# EAGLE design h-bridge-breakout (EAGLE 6.1)
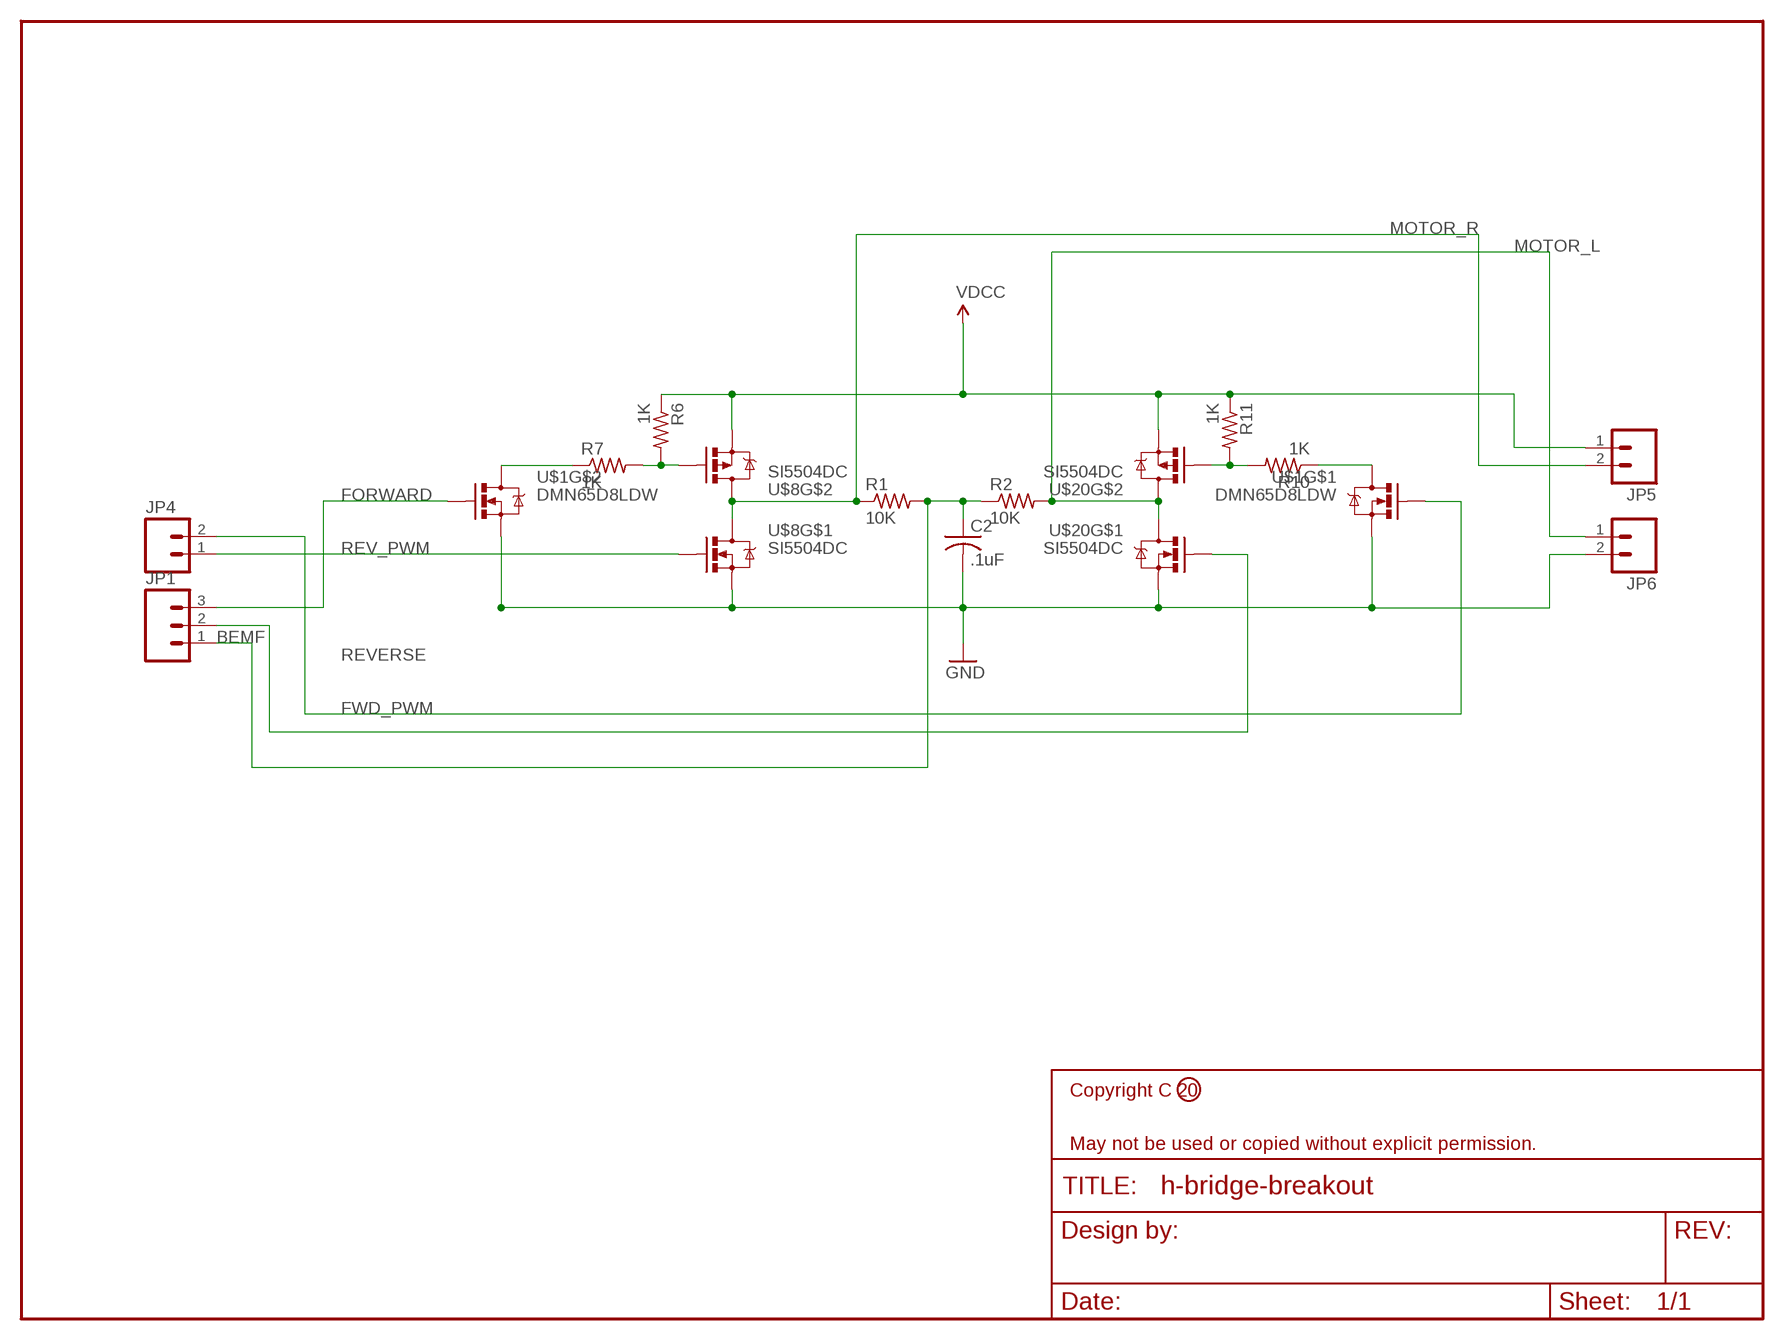
[diagram p0: schematic, sheet 1]

## Parts
C2  .1uF  C-USC0402  [C0402]
JP1  M03SCREW  [SCREWTERMINAL-3.5MM-3]
JP4  M023.5MM  [SCREWTERMINAL-3.5MM-2]
JP5  M023.5MM  [SCREWTERMINAL-3.5MM-2]
JP6  M023.5MM  [SCREWTERMINAL-3.5MM-2]
R1  10K  R-US_R0603  [R0603]
R2  10K  R-US_R0603  [R0603]
R6  1K  R-US_R0603  [R0603]
R7  1K  R-US_R0603  [R0603]
R10  1K  R-US_R0603  [R0603]
R11  1K  R-US_R0603  [R0603]
U$1  DMN65D8LDW  [SOT363]
U$8  SI5504DC  [1206-8]
U$20  SI5504DC  [1206-8]

## Nets
BEMF: C2.1 JP1.1 R1.2 R2.1
FORWARD: JP1.3 U$1.P$5(G)
FWD_PWM: JP1.2 U$20.P$2(G)
GND: C2.2 JP6.2 U$1.P$3(S) U$1.P$6(S) U$8.P$1(S) U$20.P$1(S)
MOTOR_L: JP6.1 R2.2 U$20.P$5(D) U$20.P$6(D) U$20.P$7(D) U$20.P$8(D)
MOTOR_R: JP5.2 R1.1 U$8.P$5(D) U$8.P$6(D) U$8.P$7(D) U$8.P$8(D)
N$1: R6.2 R7.2 U$8.P$4(G)
N$4: R10.2 R11.2 U$20.P$4(G)
N$10: R10.1 U$1.P$4(D)
N$11: R7.1 U$1.P$1(D)
REV_PWM: JP4.1 U$8.P$2(G)
REVERSE: JP4.2 U$1.P$2(G)
VDCC: JP5.1 R6.1 R11.1 U$8.P$3(S) U$20.P$3(S)

## Library data of the parts
C2 = rcl:C-US: CAPACITOR, American symbol
JP1 = SparkFun-Connectors:M03: Header 3 Standard 3-pin 0.1" header. Use with straight break away headers (SKU : PRT-00116), right angle break away headers (PRT-00553), swiss pins (PRT-00743), machine pins (PRT-00117), and female headers (PRT-00115). Molex polarized connector foot print use with SKU : PRT-08232 with associated crimp pins and housings.
JP4-JP6 = SparkFun-Connectors:M02: Header 2 Standard 2-pin 0.1" header. Use with straight break away headers (SKU : PRT-00116), right angle break away headers (PRT-00553), swiss pins (PRT-00743), machine pins (PRT-00117), and female headers (PRT-00115). Molex polarized connector foot print use with SKU : PRT-08233 with associated crimp pins and housings.
R1 R2 R6 R7 R10 R11 = rcl:R-US_: RESISTOR, American symbol
U$1 = Railstars:DMN65D8LDW
U$8 U$20 = Railstars:SI5504DC

## Board
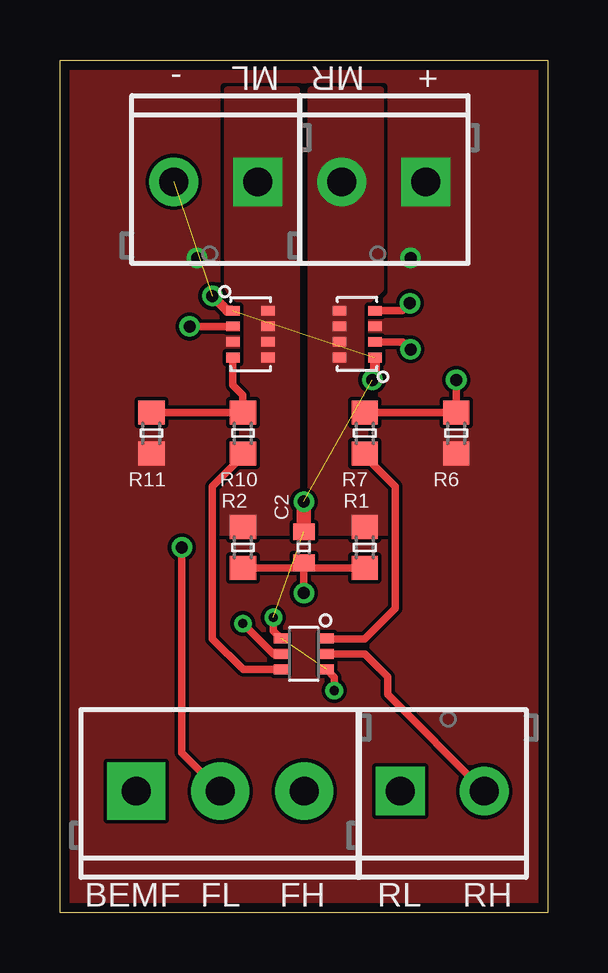
[diagram p1: board, top side]
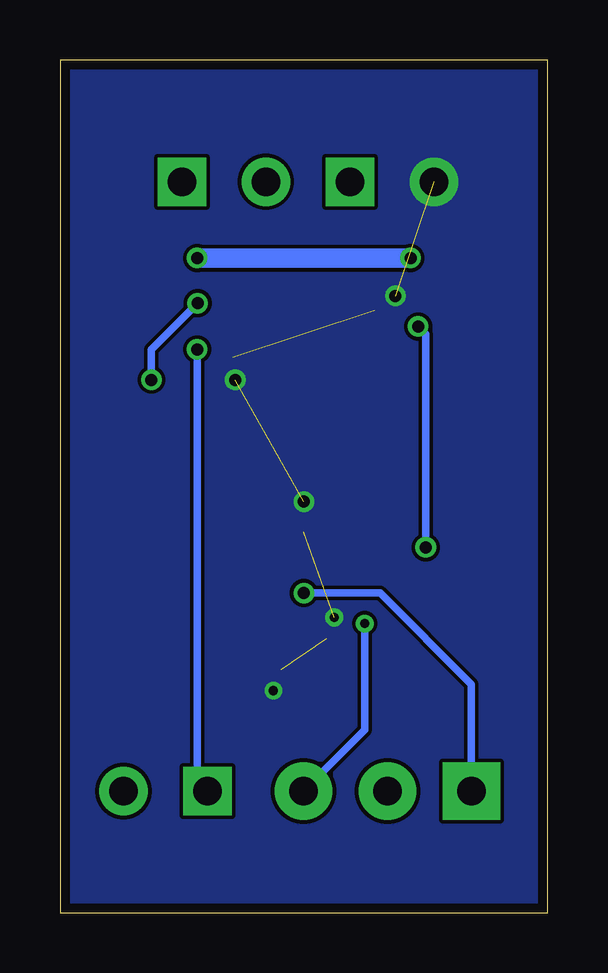
[diagram p2: board, bottom side, seen from below]

Size 20.32 x 35.56 mm. Coordinates in mm from the lower left corner, seen from the top.
Outline: 0,35.56 20.32,35.56 20.32,0 0,0 0,35.56
Copper layers (1*16): Top 0.0356mm / dielectric 1.5011mm / Bottom 0.0356mm
Design rules: minimum track width 6mil, minimum drill 13mil, track to track 6mil, track to pad 6mil, pad to pad 6mil, via to via 6mil, smd to smd 6mil, copper to edge 15mil, drill to drill 6mil, minimum pad ring 7mil, minimum via ring 7mil, stop-mask expansion 4mil, vias tented up to drill 40mil, thermal gap 10mil

### Footprints (pad centres in the part's own frame; a part is rotated, then mirrored left to right if it is on the bottom)
C0402 = smd 0.7 x 0.9: 1 -0.65,0; 2 0.65,0
SCREWTERMINAL-3.5MM-3 = drill 1.2 pad 2.413 square: 1 0,0 | drill 1.2 pad 2.413: 2 3.5,0; 3 7,0
SCREWTERMINAL-3.5MM-2 = drill 1.2 pad 2.032 square: 1 0,0 | drill 1.2 pad 2.032: 2 3.5,0
R0603 = smd 1 x 1.1: 1 -0.85,0; 2 0.85,0
SOT363 = smd 0.42 x 0.6: P$1 -0.65,0.95; P$2 0,0.95; P$3 0.65,0.95; P$4 0.65,-0.95; P$5 0,-0.95; P$6 -0.65,-0.95
1206-8 = smd 0.406 x 0.559: P$1 -0.975,-0.737; P$2 -0.325,-0.737; P$3 0.325,-0.737; P$4 0.975,-0.737; P$5 0.975,0.737; P$6 0.325,0.737; P$7 -0.325,0.737; P$8 -0.975,0.737

### Placement (x,y rotation side)
C2  10.16,15.24 90 top
JP1  3.17,5.08 0 top
JP4  14.17,5.08 0 top
JP5  15.24,30.48 180 top
JP6  8.24,30.48 180 top
R1  12.7,15.24 270 top
R2  7.62,15.24 90 top
R6  16.51,20 90 top
R7  12.7,20 90 top
R10  7.62,20 90 top
R11  3.81,20 90 top
U$1  10.16,10.8 270 top
U$8  12.38,24.13 90 top
U$20  7.94,24.13 270 top

### Tracks (layer width: path | path; a pad name or v marks a point on that pad's centre or on a via)
BEMF  (via drill 0.5)
  Top 0.305: R1.2 10.36,14.39 C2.1 | R2.1 9.96,14.39 C2.1 | v10.16,13.34 C2.1
  Bottom 0.305: v10.16,13.34 6.98,13.34 3.17,9.52 JP1.1
FORWARD  (via drill 0.38)
  Top 0.305: U$1.P$5 8.89,10.8 v7.62,12.07
  Bottom 0.305: v7.62,12.07 7.62,7.64 JP1.3
FWD_PWM  (via drill 0.5)
  Top 0.305: U$20.P$2 6.99,24.46 6.98,24.45 v5.4,24.45 | v5.08,15.24 5.08,6.68 JP1.2
  Bottom 0.305: v5.08,15.24 5.08,24.13 v5.4,24.45
GND  (via drill 0.38, 0.5)  (5 unrouted)
  Top 0.305: U$1.P$3 11.43,9.83 v11.43,9.27 | U$1.P$6 8.89,11.77 v8.89,12.32
  Top 0.406: U$8.P$1 13.12,22.33 v13.02,22.23 | U$20.P$1 6.96,25.1 v6.35,25.72
  Top 0.61: C2.2 v10.16,17.15
  pour Bottom (no thermals): 0,35.56 20.32,35.56 20.32,0 0,0
MOTOR_L
  pour Top (no thermals): 9.84,34.29 6.98,34.29 6.98,26.04 7.62,25.4 7.62,19.05 6.35,17.78 6.35,15.88 9.84,15.88
MOTOR_R
  pour Top (no thermals): 10.48,34.29 10.48,15.88 13.97,15.88 13.97,17.78 12.7,19.05 12.7,25.4 13.34,26.04 13.34,34.29
N$1  (via drill 0.5)
  Top 0.305: v16.51,22.23 R6.2 R7.2 | U$8.P$4 14.27,25.1 v14.58,25.42
  Bottom 0.305: v14.58,25.42 16.51,23.49 v16.51,22.23
N$4
  Top 0.305: U$20.P$4 7.2,22.01 7.62,21.59 R10.2 R11.2
N$10
  Top 0.305: U$1.P$4 7.63,10.15 6.35,11.43 6.35,17.78 7.62,19.05 R10.1
N$11
  Top 0.305: R7.1 12.7,19.05 13.97,17.78 13.97,12.7 12.7,11.43 11.12,11.43 U$1.P$1
REV_PWM  (via drill 0.5)
  Top 0.305: U$8.P$2 14.28,23.8 v14.6,23.49
  Bottom 0.305: v14.6,23.49 14.6,5.51 JP4.1
REVERSE
  Top 0.305: U$1.P$2 12.7,10.8 13.65,9.84 13.65,9.1 JP4.2
VDCC  (via drill 0.5)
  Bottom 0.813: v14.6,27.3 v5.71,27.3
  pour Top (rank 5, no thermals): 0,35.56 20.32,35.56 20.32,0 0,0

### Text on the board
tPlace: - | ML | MR | + | BEMF | FL | FH | RL | RH